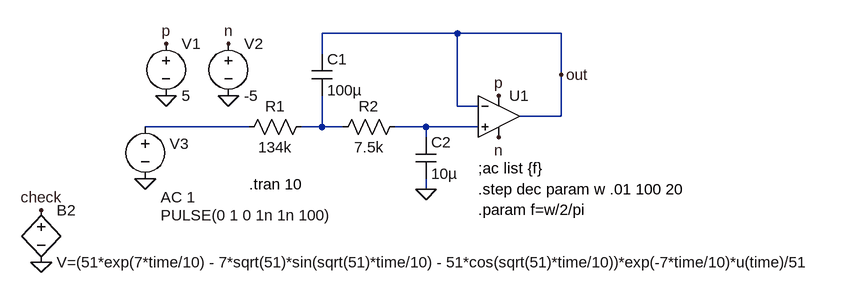
[diagram p0: schematic 20230328 Sallen Key Butterworth radian step.asc]
20230328 Sallen Key Butterworth radian step.asc, the LTspice schematic file:
Version 4
SHEET 1 980 772
WIRE 176 32 -32 32
WIRE 336 32 176 32
WIRE -32 64 -32 32
WIRE 336 96 336 32
WIRE 176 144 176 32
WIRE 208 144 176 144
WIRE 336 160 336 96
WIRE 336 160 272 160
WIRE -144 176 -304 176
WIRE -32 176 -32 128
WIRE -32 176 -64 176
WIRE 0 176 -32 176
WIRE 128 176 80 176
WIRE 208 176 128 176
WIRE 128 192 128 176
WIRE 128 272 128 256
FLAG 128 272 0
FLAG -272 128 0
FLAG -176 128 0
FLAG -272 48 p
FLAG 240 128 p
FLAG 240 192 n
FLAG -176 48 n
FLAG -304 256 0
FLAG 336 96 out
FLAG -464 384 0
FLAG -464 304 check
SYMBOL Opamps\\UniversalOpAmp1 240 160 R0
SYMATTR InstName U1
SYMBOL cap 112 192 R0
SYMATTR InstName C2
SYMATTR Value 10µ
SYMBOL res -48 160 R90
WINDOW 0 0 56 VBottom 2
WINDOW 3 32 56 VTop 2
SYMATTR InstName R1
SYMATTR Value 134k
SYMBOL res 96 160 R90
WINDOW 0 0 56 VBottom 2
WINDOW 3 32 56 VTop 2
SYMATTR InstName R2
SYMATTR Value 7.5k
SYMBOL cap -48 64 R0
SYMATTR InstName C1
SYMATTR Value 100µ
SYMBOL voltage -272 32 R0
WINDOW 123 0 0 Left 0
WINDOW 39 0 0 Left 0
SYMATTR InstName V1
SYMATTR Value 5
SYMBOL voltage -176 32 R0
WINDOW 123 0 0 Left 0
WINDOW 39 0 0 Left 0
SYMATTR InstName V2
SYMATTR Value -5
SYMBOL voltage -304 160 R0
WINDOW 0 38 42 Left 2
WINDOW 3 24 152 Left 2
WINDOW 123 24 124 Left 2
WINDOW 39 0 0 Left 0
SYMATTR InstName V3
SYMATTR Value PULSE(0 1 0 1n 1n 100)
SYMATTR Value2 AC 1
SYMBOL bv -464 288 R0
SYMATTR InstName B2
SYMATTR Value V=(51*exp(7*time/10) - 7*sqrt(51)*sin(sqrt(51)*time/10) - 51*cos(sqrt(51)*time/10))*exp(-7*time/10)*u(time)/51
TEXT 208 272 Left 2 !.step dec param w .01 100 20\n.param f=w/2/pi
TEXT 208 240 Left 2 !;ac list {f}
TEXT -144 264 Left 2 !.tran 10

The netlist it stands for:
* 20230328 Sallen Key Butterworth radian step.asc
XU1 N003 out p n out level1 Avol=1Meg GBW=10Meg Vos=0 En=0 Enk=0 In=0 Ink=0 Rin=500Meg  ; pins In+ In- V+ V- OUT
C2 N003 0 10µ
R1 N002 N001 134k
R2 N003 N002 7.5k
C1 out N002 100µ
V1 p 0 5
V2 n 0 -5
V3 N001 0 PULSE(0 1 0 1n 1n 100) AC 1
B2 check 0 V=(51*exp(7*time/10) - 7*sqrt(51)*sin(sqrt(51)*time/10) - 51*cos(sqrt(51)*time/10))*exp(-7*time/10)*u(time)/51
.step dec param w .01 100 20
.param f=w/2/pi
;ac list {f}
.tran 10
.lib UniversalOpAmp1.lib
.backanno
.end